# EAGLE design Debug_Phantom (EAGLE 7.2.0)
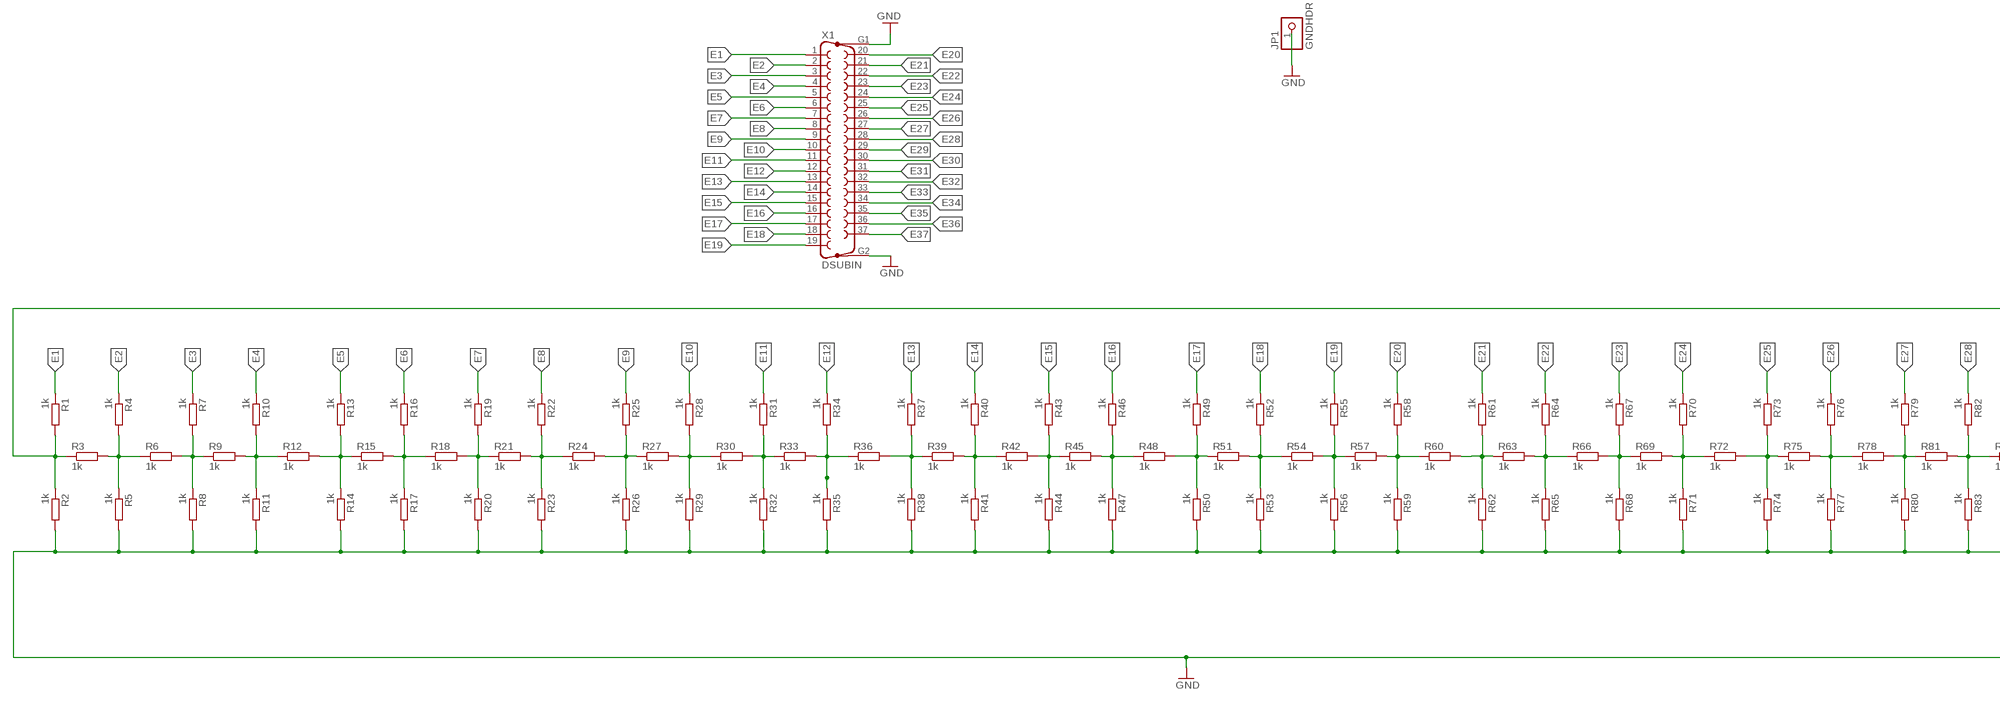
[diagram p0: schematic, sheet 1, part 1 of 2]
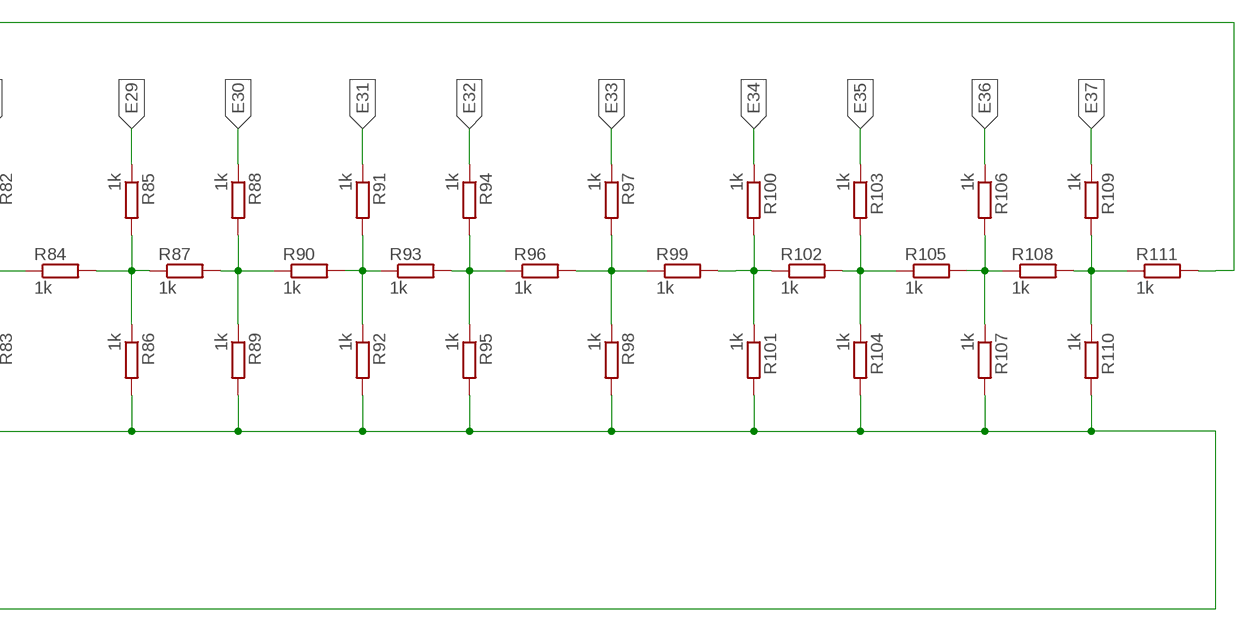
[diagram p1: schematic, sheet 1, part 2 of 2]

## Parts
JP1  GNDHDR  PINHD-1X1  [1X01]
R1  1k  R-EU_R0402  [R0402]
R2  1k  R-EU_R0402  [R0402]
R3  1k  R-EU_R0402  [R0402]
R4  1k  R-EU_R0402  [R0402]
R5  1k  R-EU_R0402  [R0402]
R6  1k  R-EU_R0402  [R0402]
R7  1k  R-EU_R0402  [R0402]
R8  1k  R-EU_R0402  [R0402]
R9  1k  R-EU_R0402  [R0402]
R10  1k  R-EU_R0402  [R0402]
R11  1k  R-EU_R0402  [R0402]
R12  1k  R-EU_R0402  [R0402]
R13  1k  R-EU_R0402  [R0402]
R14  1k  R-EU_R0402  [R0402]
R15  1k  R-EU_R0402  [R0402]
R16  1k  R-EU_R0402  [R0402]
R17  1k  R-EU_R0402  [R0402]
R18  1k  R-EU_R0402  [R0402]
R19  1k  R-EU_R0402  [R0402]
R20  1k  R-EU_R0402  [R0402]
R21  1k  R-EU_R0402  [R0402]
R22  1k  R-EU_R0402  [R0402]
R23  1k  R-EU_R0402  [R0402]
R24  1k  R-EU_R0402  [R0402]
R25  1k  R-EU_R0402  [R0402]
R26  1k  R-EU_R0402  [R0402]
R27  1k  R-EU_R0402  [R0402]
R28  1k  R-EU_R0402  [R0402]
R29  1k  R-EU_R0402  [R0402]
R30  1k  R-EU_R0402  [R0402]
R31  1k  R-EU_R0402  [R0402]
R32  1k  R-EU_R0402  [R0402]
R33  1k  R-EU_R0402  [R0402]
R34  1k  R-EU_R0402  [R0402]
R35  1k  R-EU_R0402  [R0402]
R36  1k  R-EU_R0402  [R0402]
R37  1k  R-EU_R0402  [R0402]
R38  1k  R-EU_R0402  [R0402]
R39  1k  R-EU_R0402  [R0402]
R40  1k  R-EU_R0402  [R0402]
R41  1k  R-EU_R0402  [R0402]
R42  1k  R-EU_R0402  [R0402]
R43  1k  R-EU_R0402  [R0402]
R44  1k  R-EU_R0402  [R0402]
R45  1k  R-EU_R0402  [R0402]
R46  1k  R-EU_R0402  [R0402]
R47  1k  R-EU_R0402  [R0402]
R48  1k  R-EU_R0402  [R0402]
R49  1k  R-EU_R0402  [R0402]
R50  1k  R-EU_R0402  [R0402]
R51  1k  R-EU_R0402  [R0402]
R52  1k  R-EU_R0402  [R0402]
R53  1k  R-EU_R0402  [R0402]
R54  1k  R-EU_R0402  [R0402]
R55  1k  R-EU_R0402  [R0402]
R56  1k  R-EU_R0402  [R0402]
R57  1k  R-EU_R0402  [R0402]
R58  1k  R-EU_R0402  [R0402]
R59  1k  R-EU_R0402  [R0402]
R60  1k  R-EU_R0402  [R0402]
R61  1k  R-EU_R0402  [R0402]
R62  1k  R-EU_R0402  [R0402]
R63  1k  R-EU_R0402  [R0402]
R64  1k  R-EU_R0402  [R0402]
R65  1k  R-EU_R0402  [R0402]
R66  1k  R-EU_R0402  [R0402]
R67  1k  R-EU_R0402  [R0402]
R68  1k  R-EU_R0402  [R0402]
R69  1k  R-EU_R0402  [R0402]
R70  1k  R-EU_R0402  [R0402]
R71  1k  R-EU_R0402  [R0402]
R72  1k  R-EU_R0402  [R0402]
R73  1k  R-EU_R0402  [R0402]
R74  1k  R-EU_R0402  [R0402]
R75  1k  R-EU_R0402  [R0402]
R76  1k  R-EU_R0402  [R0402]
R77  1k  R-EU_R0402  [R0402]
R78  1k  R-EU_R0402  [R0402]
R79  1k  R-EU_R0402  [R0402]
R80  1k  R-EU_R0402  [R0402]
R81  1k  R-EU_R0402  [R0402]
R82  1k  R-EU_R0402  [R0402]
R83  1k  R-EU_R0402  [R0402]
R84  1k  R-EU_R0402  [R0402]
R85  1k  R-EU_R0402  [R0402]
R86  1k  R-EU_R0402  [R0402]
R87  1k  R-EU_R0402  [R0402]
R88  1k  R-EU_R0402  [R0402]
R89  1k  R-EU_R0402  [R0402]
R90  1k  R-EU_R0402  [R0402]
R91  1k  R-EU_R0402  [R0402]
R92  1k  R-EU_R0402  [R0402]
R93  1k  R-EU_R0402  [R0402]
R94  1k  R-EU_R0402  [R0402]
R95  1k  R-EU_R0402  [R0402]
R96  1k  R-EU_R0402  [R0402]
R97  1k  R-EU_R0402  [R0402]
R98  1k  R-EU_R0402  [R0402]
R99  1k  R-EU_R0402  [R0402]
R100  1k  R-EU_R0402  [R0402]
R101  1k  R-EU_R0402  [R0402]
R102  1k  R-EU_R0402  [R0402]
R103  1k  R-EU_R0402  [R0402]
R104  1k  R-EU_R0402  [R0402]
R105  1k  R-EU_R0402  [R0402]
R106  1k  R-EU_R0402  [R0402]
R107  1k  R-EU_R0402  [R0402]
R108  1k  R-EU_R0402  [R0402]
R109  1k  R-EU_R0402  [R0402]
R110  1k  R-EU_R0402  [R0402]
R111  1k  R-EU_R0402  [R0402]
X1  DSUBIN  F37VP  [F37VP]

## Nets
E1: R1.1 X1.1
E2: R4.1 X1.2
E3: R7.1 X1.3
E4: R10.1 X1.4
E5: R13.1 X1.5
E6: R16.1 X1.6
E7: R19.1 X1.7
E8: R22.1 X1.8
E9: R25.1 X1.9
E10: R28.1 X1.10
E11: R31.1 X1.11
E12: R34.1 X1.12
E13: R37.1 X1.13
E14: R40.1 X1.14
E15: R43.1 X1.15
E16: R46.1 X1.16
E17: R49.1 X1.17
E18: R52.1 X1.18
E19: R55.1 X1.19
E20: R58.1 X1.20
E21: R61.1 X1.21
E22: R64.1 X1.22
E23: R67.1 X1.23
E24: R70.1 X1.24
E25: R73.1 X1.25
E26: R76.1 X1.26
E27: R79.1 X1.27
E28: R82.1 X1.28
E29: R85.1 X1.29
E30: R88.1 X1.30
E31: R91.1 X1.31
E32: R94.1 X1.32
E33: R97.1 X1.33
E34: R100.1 X1.34
E35: R103.1 X1.35
E36: R106.1 X1.36
E37: R109.1 X1.37
E38: R1.2 R2.1 R3.1 R111.2
E39: R3.2 R4.2 R5.1 R6.1
E40: R6.2 R7.2 R8.1 R9.1
E41: R9.2 R10.2 R11.1 R12.1
E42: R12.2 R13.2 R14.1 R15.1
E43: R15.2 R16.2 R17.1 R18.1
E44: R18.2 R19.2 R20.1 R21.1
E45: R21.2 R22.2 R23.1 R24.1
E46: R24.2 R25.2 R26.1 R27.1
E47: R27.2 R28.2 R29.1 R30.1
E48: R30.2 R31.2 R32.1 R33.1
E49: R33.2 R34.2 R35.1 R36.1
E50: R36.2 R37.2 R38.1 R39.1
E51: R39.2 R40.2 R41.1 R42.1
E52: R42.2 R43.2 R44.1 R45.1
E53: R45.2 R46.2 R47.1 R48.1
E54: R48.2 R49.2 R50.1 R51.1
E55: R51.2 R52.2 R53.1 R54.1
E56: R54.2 R55.2 R56.1 R57.1
E57: R57.2 R58.2 R59.1 R60.1
E58: R60.2 R61.2 R62.1 R63.1
E59: R63.2 R64.2 R65.1 R66.1
E60: R66.2 R67.2 R68.1 R69.1
E61: R69.2 R70.2 R71.1 R72.1
E63: R75.2 R76.2 R77.1 R78.1
E64: R78.2 R79.2 R80.1 R81.1
E65: R81.2 R82.2 R83.1 R84.1
E66: R84.2 R85.2 R86.1 R87.1
E67: R87.2 R88.2 R89.1 R90.1
E68: R90.2 R91.2 R92.1 R93.1
E69: R93.2 R94.2 R95.1 R96.1
E70: R96.2 R97.2 R98.1 R99.1
E72: R102.2 R103.2 R104.1 R105.1
E73: R105.2 R106.2 R107.1 R108.1
E74: R108.2 R109.2 R110.1 R111.1
GND: JP1.1 R2.2 R5.2 R8.2 R11.2 R14.2 R17.2 R20.2 R23.2 R26.2 R29.2 R32.2 R35.2 R38.2 R41.2 R44.2 R47.2 R50.2 R53.2 R56.2 R59.2 R62.2 R65.2 R68.2 R71.2 R74.2 R77.2 R80.2 R83.2 R86.2 R89.2 R92.2 R95.2 R98.2 R101.2 R104.2 R107.2 R110.2 X1.G1 X1.G2
N$1: R72.2 R73.2 R74.1 R75.1
N$2: R99.2 R100.2 R101.1 R102.1

## Library data of the parts
JP1 = pinhead:PINHD-1X1: PIN HEADER
R1-R111 = rcl:R-EU_: RESISTOR, European symbol
X1 = con-subd:F37VP: SUB-D; OC_FARNELL: unknown; OC_NEWARK: unknown

## Board
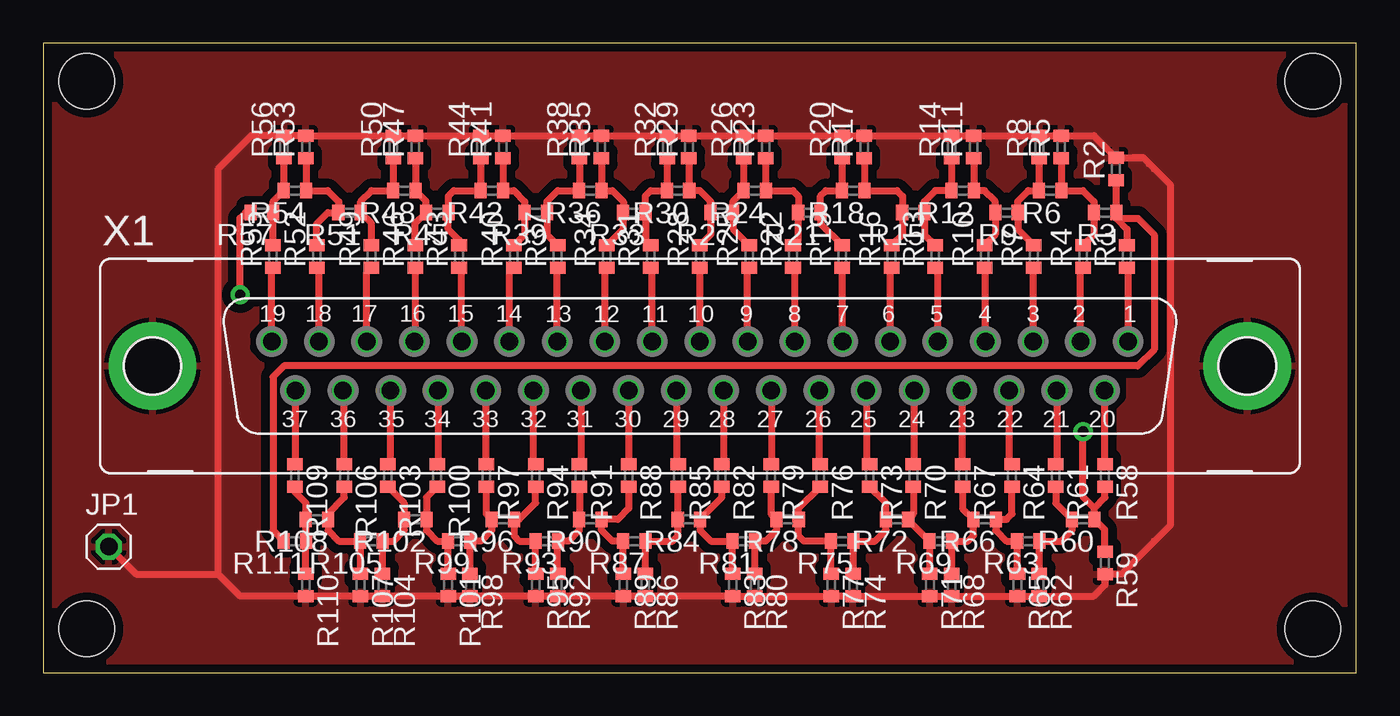
[diagram p2: board, top side]
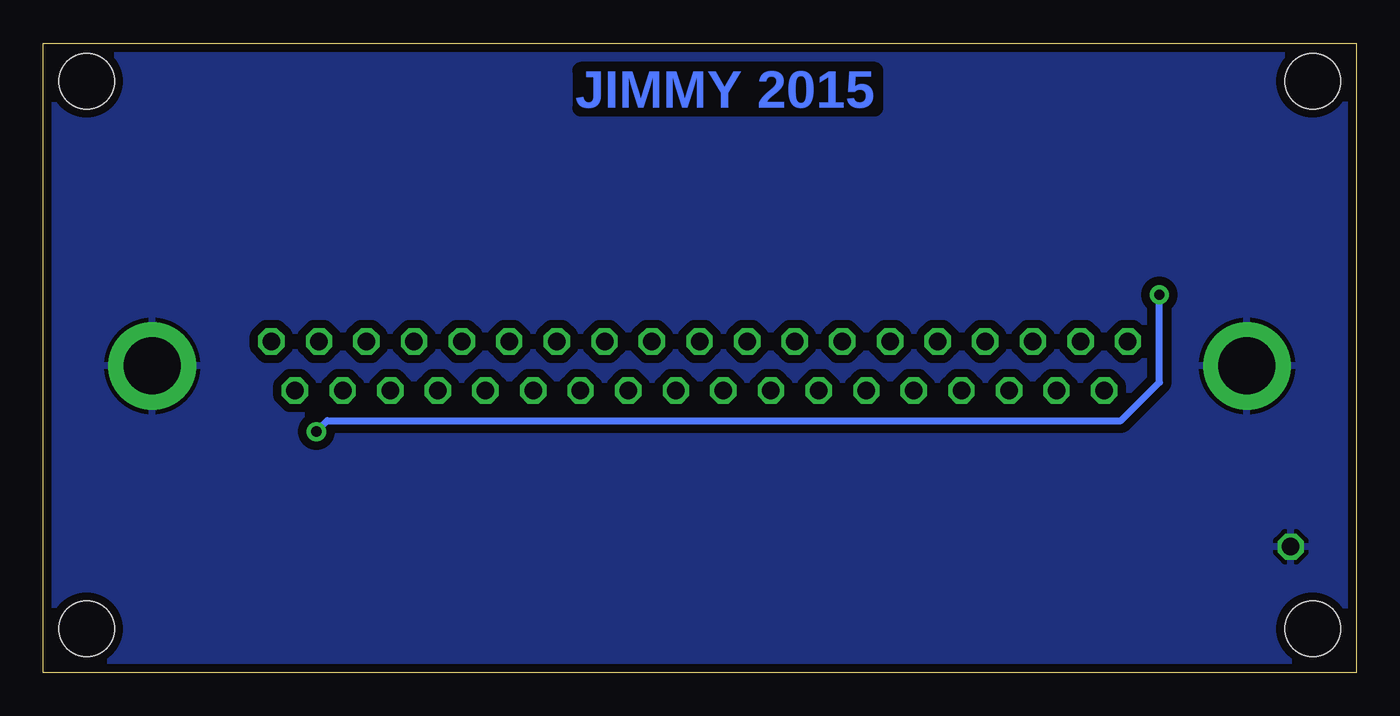
[diagram p3: board, bottom side, seen from below]

Size 76.18 x 36.5 mm. Coordinates in mm from the lower left corner, seen from the top.
Outline: 0,0 76.18,0 76.18,36.5 0,36.5 0,0
Copper layers (1*16): Top 0.035mm / dielectric 1.5mm / Bottom 0.035mm
Design rules "pcbtrain": minimum track width 0.2mm, minimum drill 0.4mm, track to track 0.2mm, track to pad 0.2mm, pad to pad 0.2mm, via to via 0.2mm, smd to smd 0mil, copper to edge 10mil, drill to drill 0.2mm, minimum pad ring 10mil, minimum via ring 10mil, stop-mask expansion 0.125mm, vias tented up to drill 0mil, thermal gap 10mil
Holes 3.2 mm at 2.54,34.29 2.54,2.54 73.66,2.54 73.66,34.29

### Footprints (pad centres in the part's own frame; a part is rotated, then mirrored left to right if it is on the bottom)
1X01 = drill 1.016 octagon: 1 0,0
R0402 = smd 0.7 x 0.9: 1 -0.65,0; 2 0.65,0
F37VP = drill 1.016 octagon: 1 24.841,1.422; 2 22.073,1.422; 3 19.329,1.422; 4 16.561,1.422; 5 13.792,1.422; 6 11.049,1.422; 7 8.28,1.422; 8 5.512,1.422; 9 2.769,1.422; 10 0,1.422; 11 -2.769,1.422; 12 -5.512,1.422; 13 -8.28,1.422; 14 -11.049,1.422; 15 -13.818,1.422; 16 -16.561,1.422; 17 -19.329,1.422; 18 -22.098,1.422; 19 -24.841,1.422; 20 23.47,-1.422; 21 20.701,-1.422; 22 17.932,-1.422; 23 15.189,-1.422; 24 12.421,-1.422; 25 9.652,-1.422; 26 6.909,-1.422; 27 4.14,-1.422; 28 1.372,-1.422; 29 -1.372,-1.422; 30 -4.14,-1.422; 31 -6.909,-1.422; 32 -9.677,-1.422; 33 -12.421,-1.422; 34 -15.189,-1.422; 35 -17.958,-1.422; 36 -20.701,-1.422; 37 -23.47,-1.422 | drill 3.302 pad 5.08: G1 -31.75,0; G2 31.75,0

### Placement (x,y rotation side)
JP1  3.81,7.3 0 top
R1  62.87,24.13 90 top
R2  62.23,29.21 90 top
R3  61.6,26.67 180 top
R4  60.32,24.13 90 top
R5  59.05,30.48 90 top
R6  58.42,27.94 180 top
R7  57.47,24.13 90 top
R8  57.79,30.48 90 top
R9  55.88,26.67 180 top
R10  54.61,24.13 90 top
R11  53.98,30.48 90 top
R12  53.34,27.94 180 top
R13  51.75,24.13 90 top
R14  52.71,30.48 90 top
R15  50.48,26.67 180 top
R16  49.21,24.13 90 top
R17  47.63,30.48 90 top
R18  46.99,27.94 180 top
R19  46.35,24.13 90 top
R20  46.35,30.48 90 top
R21  44.45,26.67 180 top
R22  43.5,24.13 90 top
R23  41.91,30.48 90 top
R24  41.27,27.94 180 top
R25  40.96,24.13 90 top
R26  40.64,30.48 90 top
R27  39.37,26.67 180 top
R28  38.1,24.13 90 top
R29  37.46,30.48 90 top
R30  36.83,27.94 180 top
R31  35.24,24.13 90 top
R32  36.2,30.48 90 top
R33  34.29,26.67 180 top
R34  32.7,24.13 90 top
R35  32.38,30.48 90 top
R36  31.75,27.94 180 top
R37  29.85,24.13 90 top
R38  31.12,30.48 90 top
R39  28.57,26.67 180 top
R40  27.3,24.13 90 top
R41  26.67,30.48 90 top
R42  26.04,27.94 180 top
R43  24.13,24.13 90 top
R44  25.4,30.48 90 top
R45  22.86,26.67 180 top
R46  21.59,24.13 90 top
R47  21.59,30.48 90 top
R48  20.96,27.94 180 top
R49  19.05,24.13 90 top
R50  20.32,30.48 90 top
R51  17.78,26.67 180 top
R52  15.88,24.13 90 top
R53  15.24,30.48 90 top
R54  14.61,27.94 180 top
R55  13.34,24.13 90 top
R56  13.97,30.48 90 top
R57  12.7,26.67 180 top
R58  61.6,11.43 270 top
R59  61.6,6.35 270 top
R60  60.32,8.89 180 top
R61  58.74,11.43 270 top
R62  57.79,5.08 270 top
R63  57.15,7.62 180 top
R64  56.2,11.43 270 top
R65  56.52,5.08 270 top
R66  54.61,8.89 180 top
R67  53.34,11.43 270 top
R68  52.71,5.08 270 top
R69  52.07,7.62 180 top
R70  50.48,11.43 270 top
R71  51.44,5.08 270 top
R72  49.53,8.89 180 top
R73  47.94,11.43 270 top
R74  46.99,5.08 270 top
R75  46.35,7.62 180 top
R76  45.09,11.43 270 top
R77  45.72,5.08 270 top
R78  43.18,8.89 180 top
R79  42.23,11.43 270 top
R80  41.27,5.08 270 top
R81  40.64,7.62 180 top
R82  39.37,11.43 270 top
R83  40.01,5.08 270 top
R84  37.46,8.89 180 top
R85  36.83,11.43 270 top
R86  34.93,5.08 270 top
R87  34.29,7.62 180 top
R88  33.97,11.43 270 top
R89  33.66,5.08 270 top
R90  31.75,8.89 180 top
R91  31.12,11.43 270 top
R92  29.85,5.08 270 top
R93  29.21,7.62 180 top
R94  28.57,11.43 270 top
R95  28.57,5.08 270 top
R96  26.67,8.89 180 top
R97  25.72,11.43 270 top
R98  24.77,5.08 270 top
R99  24.13,7.62 180 top
R100  22.86,11.43 270 top
R101  23.5,5.08 270 top
R102  21.59,8.89 180 top
R103  20,11.43 270 top
R104  19.69,5.08 270 top
R105  19.05,7.62 180 top
R106  17.46,11.43 270 top
R107  18.41,5.08 270 top
R108  15.88,8.89 180 top
R109  14.61,11.43 270 top
R110  15.24,5.08 270 top
R111  14.61,7.62 180 top
X1  38.1,17.78 0 top

### Tracks (layer width: path | path; a pad name or v marks a point on that pad's centre or on a via)
E1
  Top 0.406: X1.1 62.94,23.4 R1.1
E2
  Top 0.406: X1.2 60.17,23.33 R4.1
E3
  Top 0.406: X1.3 57.43,23.44 R7.1
E4
  Top 0.406: X1.4 54.66,23.43 R10.1
E5
  Top 0.406: X1.5 51.89,23.34 R13.1
E6
  Top 0.406: X1.6 49.15,23.42 R16.1
E7
  Top 0.406: X1.7 46.38,23.46 R19.1
E8
  Top 0.406: X1.8 43.61,23.37 R22.1
E9
  Top 0.406: X1.9 40.87,23.39 R25.1
E10
  Top 0.406: X1.10 R28.1
E11
  Top 0.406: X1.11 35.33,23.39 R31.1
E12
  Top 0.406: X1.12 32.59,23.37 R34.1
E13
  Top 0.406: X1.13 29.82,23.46 R37.1
E14
  Top 0.406: X1.14 27.05,23.23 R40.1
E15
  Top 0.406: X1.15 24.28,23.33 R43.1
E16
  Top 0.406: R46.1 21.59,19.25 X1.16
E17
  Top 0.406: X1.17 18.77,23.2 R49.1
E18
  Top 0.406: X1.18 16,23.35 R52.1
E19
  Top 0.406: X1.19 13.26,23.4 R55.1
E20
  Top 0.406: X1.20 61.57,12.11 R58.1
E21
  Top 0.406: X1.21 58.8,12.14 R61.1
E22
  Top 0.406: X1.22 56.03,12.25 R64.1
E23
  Top 0.406: X1.23 53.29,12.13 R67.1
E24
  Top 0.406: X1.24 50.52,12.12 R70.1
E25
  Top 0.406: X1.25 47.75,12.27 R73.1
E26
  Top 0.406: X1.26 45.01,12.16 R76.1
E27
  Top 0.406: X1.27 42.24,12.09 R79.1
E28
  Top 0.406: X1.28 39.47,12.18 R82.1
E29
  Top 0.406: X1.29 36.73,12.18 R85.1
E30
  Top 0.406: X1.30 33.96,12.09 R88.1
E31
  Top 0.406: X1.31 31.19,12.16 R91.1
E32
  Top 0.406: X1.32 28.42,12.23 R94.1
E33
  Top 0.406: X1.33 25.68,12.12 R97.1
E34
  Top 0.406: X1.34 22.91,12.13 R100.1
E35
  Top 0.406: X1.35 20.14,12.22 R103.1
E36
  Top 0.406: R106.1 17.46,16.29 X1.36
E37
  Top 0.406: X1.37 14.63,12.11 R109.1
E38
  Top 0.406: R2.1 62.23,26.69 R3.1 62.24,26.34 | 62.24,26.34 62.87,25.72 R1.2 | 62.24,26.34 63.52,26.34 64.45,25.4 64.45,18.73 63.5,17.78 13.97,17.78 13.34,17.15 13.34,8.24 R111.2
E39
  Top 0.406: R5.1 59.07,29.83 R6.1 60.32,27.94 60.96,27.3 60.96,26.69 R3.2 60.95,25.4 R4.2
E40
  Top 0.406: R8.1 57.77,29.83 R6.2 57.15,27.94 56.53,27.32 R9.1 56.53,25.72 R7.2
E41
  Top 0.406: R11.1 53.99,29.83 R12.1 54.61,27.94 55.23,27.32 R9.2 55.23,25.4 R10.2
E42
  Top 0.406: R14.1 52.69,29.83 R12.2 51.75,27.94 51.12,27.3 51.12,26.69 R15.1 51.13,25.4 R13.2
E43
  Top 0.406: R17.1 R18.1 49.53,27.94 49.85,27.62 49.85,26.69 R15.2 49.83,25.4 R16.2
E44
  Top 0.406: R20.1 R18.2 45.4,27.94 45.1,27.64 R21.1 45.1,26.04 R19.2
E45
  Top 0.406: R23.1 41.91,27.96 R24.1 43.5,27.94 43.82,27.62 43.82,26.69 R21.2 43.8,25.08 R22.2
E46
  Top 0.406: R26.1 40.64,27.96 R24.2 40.02,27.34 R27.1 40.02,25.72 R25.2
E47
  Top 0.406: R29.1 37.46,27.96 R30.1 38.1,27.94 38.72,27.32 R27.2 38.72,25.4 R28.2
E48
  Top 0.406: R32.1 36.2,27.96 R30.2 35.24,27.94 34.94,27.64 R33.1 34.94,25.08 R31.2
E49
  Top 0.406: R35.1 32.38,27.96 R36.1 33.02,27.94 33.66,27.3 33.66,26.69 R33.2 33.64,25.72 R34.2
E50
  Top 0.406: R38.1 31.12,27.96 R36.2 29.85,27.94 29.23,27.32 R39.1 29.23,25.4 R37.2
E51
  Top 0.406: R41.1 26.69,29.83 R42.1 27.3,27.94 27.94,27.3 27.94,26.69 R39.2 27.93,25.4 R40.2
E52
  Top 0.406: R44.1 25.38,29.83 R42.2 23.81,27.94 23.51,27.64 R45.1 23.5,26.66 23.5,25.72 24.13,25.08 R43.2
E53
  Top 0.406: R47.1 21.61,29.83 R48.1 22.21,27.34 R45.2 21.59,26.05 R46.2
E54
  Top 0.406: R50.1 20.3,29.83 R48.2 19.05,27.94 18.43,27.32 R51.1 19.05,26.05 R49.2
E55
  Top 0.406: R53.1 15.26,29.83 R54.1 16.51,27.94 17.15,27.3 17.15,26.69 R51.2 16.51,26.67 15.88,26.04 R52.2
E56
  Top 0.406: R56.1 13.96,29.83 R54.2 13.35,27.34 R57.1 13.34,26.66 R55.2
E57  (via drill 0.6)
  Top 0.406: R59.1 61.58,8.29 R60.1 60.98,9.54 | 60.98,9.54 61.6,10.16 R58.2 | 60.98,9.54 60.32,10.19 v60.32,13.97 | v11.43,21.91 11.43,26.35 11.75,26.67 R57.2
  Bottom 0.406: v60.32,13.97 59.69,14.61 13.65,14.61 11.43,16.83 v11.43,21.91
E58
  Top 0.406: R62.1 57.79,7.61 R63.1 59.05,7.62 59.69,8.26 59.69,8.88 R60.2 58.74,9.83 R61.2
E59
  Top 0.406: R65.1 56.52,7.61 R63.2 55.88,7.62 55.26,8.24 R66.1 55.88,8.89 56.2,9.21 R64.2
E60
  Top 0.406: R68.1 52.71,7.61 R69.1 53.66,7.62 53.98,7.94 53.98,8.88 R66.2 53.34,9.51 R67.2
E61
  Top 0.406: R71.1 51.44,7.61 R69.2 50.18,8.86 R72.1 50.48,9.19 R70.2
E63
  Top 0.406: R77.1 45.71,5.73 R75.2 44.13,7.62 43.82,7.94 43.82,8.88 R78.1 43.83,9.53 R76.2
E64
  Top 0.406: R80.1 41.29,5.73 R81.1 41.91,7.62 42.53,8.24 R78.2 42.23,9.19 R79.2
E65
  Top 0.406: R83.1 39.99,5.73 R81.2 38.74,7.62 38.12,8.24 R84.1 38.12,8.91 39.37,10.16 R82.2
E66
  Top 0.406: R86.1 R87.1 36.51,7.62 36.83,7.94 36.83,8.88 R84.2 36.82,10.77 R85.2
E67
  Top 0.406: R89.1 33.64,5.73 R87.2 33.02,7.62 32.38,8.26 32.38,8.88 R90.1 33.34,8.89 33.97,9.53 R88.2
E68
  Top 0.406: R92.1 29.85,7.61 R93.1 30.48,7.62 31.1,8.24 R90.2 31.12,8.91 R91.2
E69
  Top 0.406: R95.1 28.57,7.61 R93.2 27.62,7.62 27.32,7.92 R96.1 27.62,8.89 28.57,9.84 R94.2
E70
  Top 0.406: R98.1 24.77,7.61 R99.1 25.4,7.62 26.02,8.24 R96.2 25.72,9.19 R97.2
E72
  Top 0.406: R104.1 19.69,7.61 R105.1 20.32,7.62 20.96,8.26 20.96,8.88 R102.2 20.94,9.84 R103.2
E73
  Top 0.406: R107.1 18.41,7.61 R105.2 17.15,7.62 16.53,8.24 R108.1 16.53,9.22 17.46,10.16 R106.2
E74
  Top 0.406: R109.2 14.61,10.48 15.24,9.84 15.24,8.91 R108.2 15.23,7.65 R111.1 15.24,7.61 R110.1
GND
  Top 0.406: 63.82,29.85 63.8,29.86 R2.2 60.96,31.13 R5.2 R8.2 R11.2 R14.2 R17.2 R20.2 R23.2 R26.2 R29.2 R32.2 R35.2 R38.2 R41.2 R44.2 R47.2 R50.2 R53.2 R56.2 12.08,31.13 12.07,31.12 10.16,29.21 10.16,5.72 | 63.82,29.85 64.13,29.53 | 64.13,29.53 64.45,29.21 | 64.13,29.53 65.41,28.26 65.41,8.57 64.45,7.62 62.55,5.72 61.61,5.72 R59.2 61.6,5.08 60.95,4.43 R62.2 R65.2 R68.2 R71.2 R74.2 R77.2 R80.2 R83.2 R86.2 R89.2 R92.2 R95.2 R98.2 R101.2 R104.2 R107.2 R110.2 11.45,4.43 10.16,5.72 | 64.13,29.53 63.82,29.85 | 63.82,29.85 63.5,29.85 63.18,29.85 | JP1.1 5.4,5.72 10.16,5.72
  pour Top (isolate 0.5): -0.63,37.46 -0.63,-0.63 77.47,-0.63 77.47,37.46
  pour Bottom (isolate 0.5): -1.27,39.37 -1.27,-1.27 78.74,-1.27 78.74,39.37
N$1
  Top 0.406: R74.1 47.01,5.73 R75.1 48.26,7.62 48.58,7.94 48.9,8.26 48.9,8.88 R72.2 48.88,9.84 R73.2
N$2
  Top 0.406: R101.1 23.5,7.61 R99.2 22.86,7.62 22.24,8.24 R102.1 22.24,10.16 R100.2

### Text on the board
Bottom: JIMMY 2015
tText: DEBUG PHANTOM | Gnd | Gnd | Gnd | Please dont calibrate using this